# Altium schematic sheet WS2812B.SchDoc
size A3; SheetNumber: 3; SheetTotal: 4
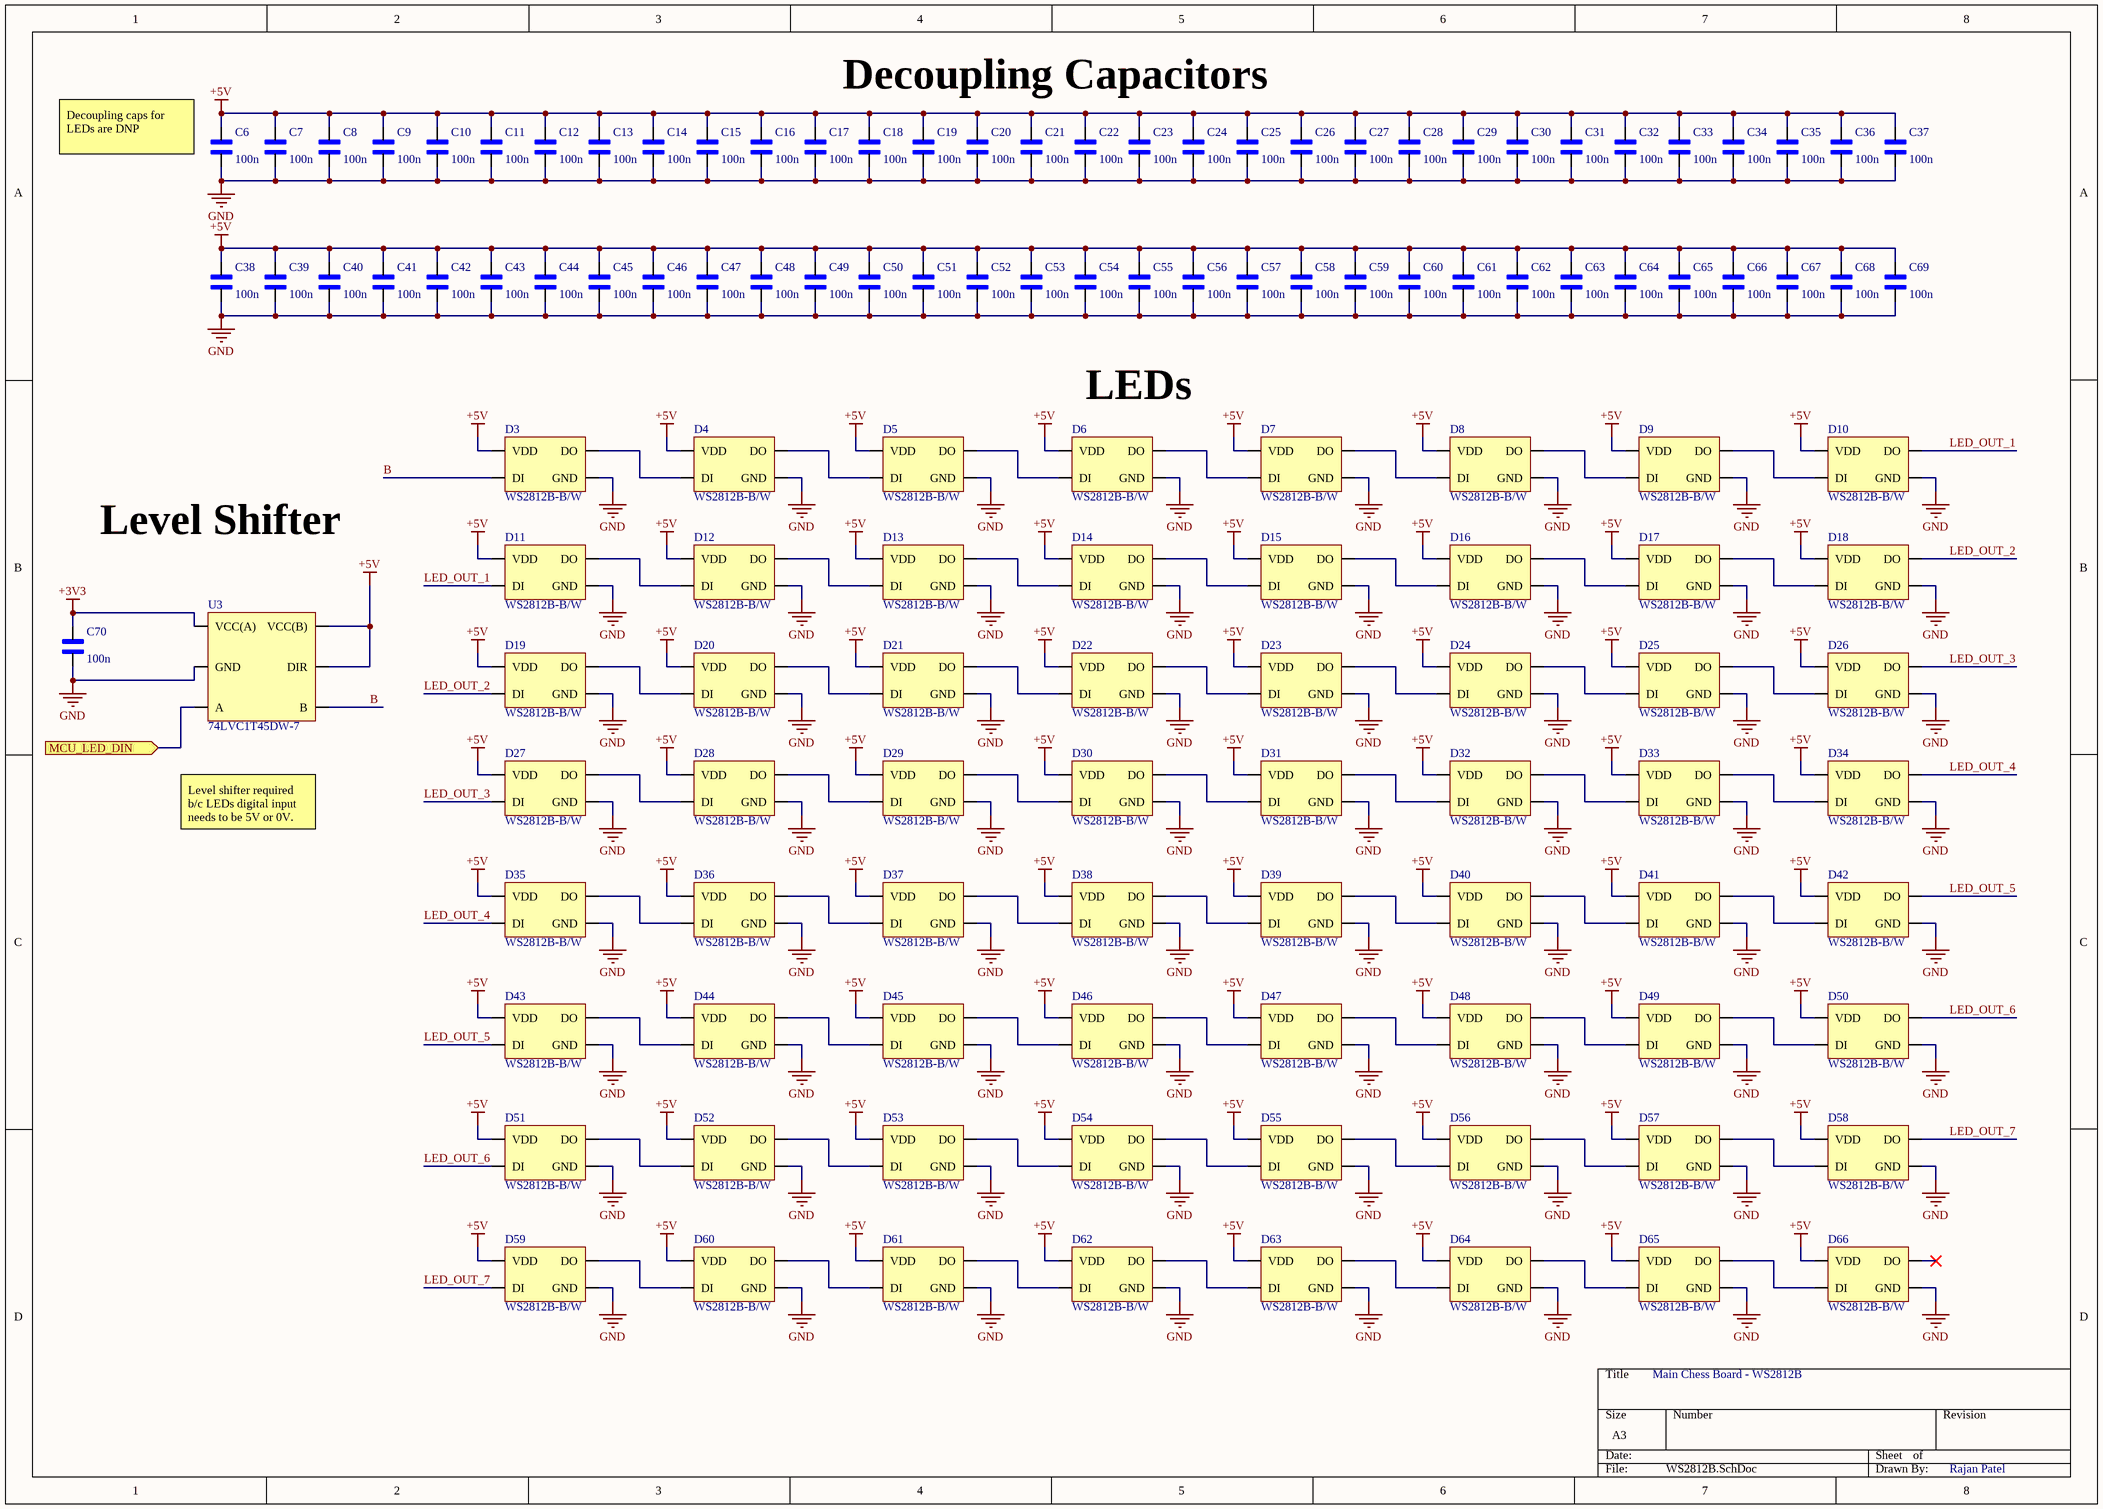
[diagram p0: WS2812B.SchDoc]

## Parts
C6  100n  [CAP 0805]
C7  100n  [CAP 0805]
C8  100n  [CAP 0805]
C9  100n  [CAP 0805]
C10  100n  [CAP 0805]
C11  100n  [CAP 0805]
C12  100n  [CAP 0805]
C13  100n  [CAP 0805]
C14  100n  [CAP 0805]
C15  100n  [CAP 0805]
C16  100n  [CAP 0805]
C17  100n  [CAP 0805]
C18  100n  [CAP 0805]
C19  100n  [CAP 0805]
C20  100n  [CAP 0805]
C21  100n  [CAP 0805]
C22  100n  [CAP 0805]
C23  100n  [CAP 0805]
C24  100n  [CAP 0805]
C25  100n  [CAP 0805]
C26  100n  [CAP 0805]
C27  100n  [CAP 0805]
C28  100n  [CAP 0805]
C29  100n  [CAP 0805]
C30  100n  [CAP 0805]
C31  100n  [CAP 0805]
C32  100n  [CAP 0805]
C33  100n  [CAP 0805]
C34  100n  [CAP 0805]
C35  100n  [CAP 0805]
C36  100n  [CAP 0805]
C37  100n  [CAP 0805]
C38  100n  [CAP 0805]
C39  100n  [CAP 0805]
C40  100n  [CAP 0805]
C41  100n  [CAP 0805]
C42  100n  [CAP 0805]
C43  100n  [CAP 0805]
C44  100n  [CAP 0805]
C45  100n  [CAP 0805]
C46  100n  [CAP 0805]
C47  100n  [CAP 0805]
C48  100n  [CAP 0805]
C49  100n  [CAP 0805]
C50  100n  [CAP 0805]
C51  100n  [CAP 0805]
C52  100n  [CAP 0805]
C53  100n  [CAP 0805]
C54  100n  [CAP 0805]
C55  100n  [CAP 0805]
C56  100n  [CAP 0805]
C57  100n  [CAP 0805]
C58  100n  [CAP 0805]
C59  100n  [CAP 0805]
C60  100n  [CAP 0805]
C61  100n  [CAP 0805]
C62  100n  [CAP 0805]
C63  100n  [CAP 0805]
C64  100n  [CAP 0805]
C65  100n  [CAP 0805]
C66  100n  [CAP 0805]
C67  100n  [CAP 0805]
C68  100n  [CAP 0805]
C69  100n  [CAP 0805]
C70  100n  [CAP 0805]
D3  WS2812B-B/W  [WS2812B-B/W]
D4  WS2812B-B/W  [WS2812B-B/W]
D5  WS2812B-B/W  [WS2812B-B/W]
D6  WS2812B-B/W  [WS2812B-B/W]
D7  WS2812B-B/W  [WS2812B-B/W]
D8  WS2812B-B/W  [WS2812B-B/W]
D9  WS2812B-B/W  [WS2812B-B/W]
D10  WS2812B-B/W  [WS2812B-B/W]
D11  WS2812B-B/W  [WS2812B-B/W]
D12  WS2812B-B/W  [WS2812B-B/W]
D13  WS2812B-B/W  [WS2812B-B/W]
D14  WS2812B-B/W  [WS2812B-B/W]
D15  WS2812B-B/W  [WS2812B-B/W]
D16  WS2812B-B/W  [WS2812B-B/W]
D17  WS2812B-B/W  [WS2812B-B/W]
D18  WS2812B-B/W  [WS2812B-B/W]
D19  WS2812B-B/W  [WS2812B-B/W]
D20  WS2812B-B/W  [WS2812B-B/W]
D21  WS2812B-B/W  [WS2812B-B/W]
D22  WS2812B-B/W  [WS2812B-B/W]
D23  WS2812B-B/W  [WS2812B-B/W]
D24  WS2812B-B/W  [WS2812B-B/W]
D25  WS2812B-B/W  [WS2812B-B/W]
D26  WS2812B-B/W  [WS2812B-B/W]
D27  WS2812B-B/W  [WS2812B-B/W]
D28  WS2812B-B/W  [WS2812B-B/W]
D29  WS2812B-B/W  [WS2812B-B/W]
D30  WS2812B-B/W  [WS2812B-B/W]
D31  WS2812B-B/W  [WS2812B-B/W]
D32  WS2812B-B/W  [WS2812B-B/W]
D33  WS2812B-B/W  [WS2812B-B/W]
D34  WS2812B-B/W  [WS2812B-B/W]
D35  WS2812B-B/W  [WS2812B-B/W]
D36  WS2812B-B/W  [WS2812B-B/W]
D37  WS2812B-B/W  [WS2812B-B/W]
D38  WS2812B-B/W  [WS2812B-B/W]
D39  WS2812B-B/W  [WS2812B-B/W]
D40  WS2812B-B/W  [WS2812B-B/W]
D41  WS2812B-B/W  [WS2812B-B/W]
D42  WS2812B-B/W  [WS2812B-B/W]
D43  WS2812B-B/W  [WS2812B-B/W]
D44  WS2812B-B/W  [WS2812B-B/W]
D45  WS2812B-B/W  [WS2812B-B/W]
D46  WS2812B-B/W  [WS2812B-B/W]
D47  WS2812B-B/W  [WS2812B-B/W]
D48  WS2812B-B/W  [WS2812B-B/W]
D49  WS2812B-B/W  [WS2812B-B/W]
D50  WS2812B-B/W  [WS2812B-B/W]
D51  WS2812B-B/W  [WS2812B-B/W]
D52  WS2812B-B/W  [WS2812B-B/W]
D53  WS2812B-B/W  [WS2812B-B/W]
D54  WS2812B-B/W  [WS2812B-B/W]
D55  WS2812B-B/W  [WS2812B-B/W]
D56  WS2812B-B/W  [WS2812B-B/W]
D57  WS2812B-B/W  [WS2812B-B/W]
D58  WS2812B-B/W  [WS2812B-B/W]
D59  WS2812B-B/W  [WS2812B-B/W]
D60  WS2812B-B/W  [WS2812B-B/W]
D61  WS2812B-B/W  [WS2812B-B/W]
D62  WS2812B-B/W  [WS2812B-B/W]
D63  WS2812B-B/W  [WS2812B-B/W]
D64  WS2812B-B/W  [WS2812B-B/W]
D65  WS2812B-B/W  [WS2812B-B/W]
D66  WS2812B-B/W  [WS2812B-B/W]
U3  74LVC1T45DW-7  [74LVC1T45DW-7]

## Ports
MCU_LED_DIN (in, see Microcontroller and Power Management[2C])

## Nets
+3V3: C70.2 U3.1(VCC(A))
+5V: C6.2 C7.2 C8.2 C9.2 C10.2 C11.2 C12.2 C13.2 C14.2 C15.2 C16.2 C17.2 C18.2 C19.2 C20.2 C21.2 C22.2 C23.2 C24.2 C25.2 C26.2 C27.2 C28.2 C29.2 C30.2 C31.2 C32.2 C33.2 C34.2 C35.2 C36.2 C37.2 C38.2 C39.2 C40.2 C41.2 C42.2 C43.2 C44.2 C45.2 C46.2 C47.2 C48.2 C49.2 C50.2 C51.2 C52.2 C53.2 C54.2 C55.2 C56.2 C57.2 C58.2 C59.2 C60.2 C61.2 C62.2 C63.2 C64.2 C65.2 C66.2 C67.2 C68.2 C69.2 D3.1(VDD) D4.1(VDD) D5.1(VDD) D6.1(VDD) D7.1(VDD) D8.1(VDD) D9.1(VDD) D10.1(VDD) D11.1(VDD) D12.1(VDD) D13.1(VDD) D14.1(VDD) D15.1(VDD) D16.1(VDD) D17.1(VDD) D18.1(VDD) D19.1(VDD) D20.1(VDD) D21.1(VDD) D22.1(VDD) D23.1(VDD) D24.1(VDD) D25.1(VDD) D26.1(VDD) D27.1(VDD) D28.1(VDD) D29.1(VDD) D30.1(VDD) D31.1(VDD) D32.1(VDD) D33.1(VDD) D34.1(VDD) D35.1(VDD) D36.1(VDD) D37.1(VDD) D38.1(VDD) D39.1(VDD) D40.1(VDD) D41.1(VDD) D42.1(VDD) D43.1(VDD) D44.1(VDD) D45.1(VDD) D46.1(VDD) D47.1(VDD) D48.1(VDD) D49.1(VDD) D50.1(VDD) D51.1(VDD) D52.1(VDD) D53.1(VDD) D54.1(VDD) D55.1(VDD) D56.1(VDD) D57.1(VDD) D58.1(VDD) D59.1(VDD) D60.1(VDD) D61.1(VDD) D62.1(VDD) D63.1(VDD) D64.1(VDD) D65.1(VDD) D66.1(VDD) U3.5(DIR) U3.6(VCC(B))
GND: C6.1 C7.1 C8.1 C9.1 C10.1 C11.1 C12.1 C13.1 C14.1 C15.1 C16.1 C17.1 C18.1 C19.1 C20.1 C21.1 C22.1 C23.1 C24.1 C25.1 C26.1 C27.1 C28.1 C29.1 C30.1 C31.1 C32.1 C33.1 C34.1 C35.1 C36.1 C37.1 C38.1 C39.1 C40.1 C41.1 C42.1 C43.1 C44.1 C45.1 C46.1 C47.1 C48.1 C49.1 C50.1 C51.1 C52.1 C53.1 C54.1 C55.1 C56.1 C57.1 C58.1 C59.1 C60.1 C61.1 C62.1 C63.1 C64.1 C65.1 C66.1 C67.1 C68.1 C69.1 C70.1 D3.4(GND) D4.4(GND) D5.4(GND) D6.4(GND) D7.4(GND) D8.4(GND) D9.4(GND) D10.4(GND) D11.4(GND) D12.4(GND) D13.4(GND) D14.4(GND) D15.4(GND) D16.4(GND) D17.4(GND) D18.4(GND) D19.4(GND) D20.4(GND) D21.4(GND) D22.4(GND) D23.4(GND) D24.4(GND) D25.4(GND) D26.4(GND) D27.4(GND) D28.4(GND) D29.4(GND) D30.4(GND) D31.4(GND) D32.4(GND) D33.4(GND) D34.4(GND) D35.4(GND) D36.4(GND) D37.4(GND) D38.4(GND) D39.4(GND) D40.4(GND) D41.4(GND) D42.4(GND) D43.4(GND) D44.4(GND) D45.4(GND) D46.4(GND) D47.4(GND) D48.4(GND) D49.4(GND) D50.4(GND) D51.4(GND) D52.4(GND) D53.4(GND) D54.4(GND) D55.4(GND) D56.4(GND) D57.4(GND) D58.4(GND) D59.4(GND) D60.4(GND) D61.4(GND) D62.4(GND) D63.4(GND) D64.4(GND) D65.4(GND) D66.4(GND) U3.2(GND)
B: D3.2(DI) U3.4(B)
LED_OUT_1: D10.3(DO) D11.2(DI)
LED_OUT_2: D18.3(DO) D19.2(DI)
LED_OUT_3: D26.3(DO) D27.2(DI)
LED_OUT_4: D34.3(DO) D35.2(DI)
LED_OUT_5: D42.3(DO) D43.2(DI)
LED_OUT_6: D50.3(DO) D51.2(DI)
LED_OUT_7: D58.3(DO) D59.2(DI)
MCU_LED_DIN: U3.3(A) ; port MCU_LED_DIN
NetD3_3: D3.3(DO) D4.2(DI)
NetD4_3: D4.3(DO) D5.2(DI)
NetD5_3: D5.3(DO) D6.2(DI)
NetD6_3: D6.3(DO) D7.2(DI)
NetD7_3: D7.3(DO) D8.2(DI)
NetD8_3: D8.3(DO) D9.2(DI)
NetD9_3: D9.3(DO) D10.2(DI)
NetD11_3: D11.3(DO) D12.2(DI)
NetD12_3: D12.3(DO) D13.2(DI)
NetD13_3: D13.3(DO) D14.2(DI)
NetD14_3: D14.3(DO) D15.2(DI)
NetD15_3: D15.3(DO) D16.2(DI)
NetD16_3: D16.3(DO) D17.2(DI)
NetD17_3: D17.3(DO) D18.2(DI)
NetD19_3: D19.3(DO) D20.2(DI)
NetD20_3: D20.3(DO) D21.2(DI)
NetD21_3: D21.3(DO) D22.2(DI)
NetD22_3: D22.3(DO) D23.2(DI)
NetD23_3: D23.3(DO) D24.2(DI)
NetD24_3: D24.3(DO) D25.2(DI)
NetD25_3: D25.3(DO) D26.2(DI)
NetD27_3: D27.3(DO) D28.2(DI)
NetD28_3: D28.3(DO) D29.2(DI)
NetD29_3: D29.3(DO) D30.2(DI)
NetD30_3: D30.3(DO) D31.2(DI)
NetD31_3: D31.3(DO) D32.2(DI)
NetD32_3: D32.3(DO) D33.2(DI)
NetD33_3: D33.3(DO) D34.2(DI)
NetD35_3: D35.3(DO) D36.2(DI)
NetD36_3: D36.3(DO) D37.2(DI)
NetD37_3: D37.3(DO) D38.2(DI)
NetD38_3: D38.3(DO) D39.2(DI)
NetD39_3: D39.3(DO) D40.2(DI)
NetD40_3: D40.3(DO) D41.2(DI)
NetD41_3: D41.3(DO) D42.2(DI)
NetD43_3: D43.3(DO) D44.2(DI)
NetD44_3: D44.3(DO) D45.2(DI)
NetD45_3: D45.3(DO) D46.2(DI)
NetD46_3: D46.3(DO) D47.2(DI)
NetD47_3: D47.3(DO) D48.2(DI)
NetD48_3: D48.3(DO) D49.2(DI)
NetD49_3: D49.3(DO) D50.2(DI)
NetD51_3: D51.3(DO) D52.2(DI)
NetD52_3: D52.3(DO) D53.2(DI)
NetD53_3: D53.3(DO) D54.2(DI)
NetD54_3: D54.3(DO) D55.2(DI)
NetD55_3: D55.3(DO) D56.2(DI)
NetD56_3: D56.3(DO) D57.2(DI)
NetD57_3: D57.3(DO) D58.2(DI)
NetD59_3: D59.3(DO) D60.2(DI)
NetD60_3: D60.3(DO) D61.2(DI)
NetD61_3: D61.3(DO) D62.2(DI)
NetD62_3: D62.3(DO) D63.2(DI)
NetD63_3: D63.3(DO) D64.2(DI)
NetD64_3: D64.3(DO) D65.2(DI)
NetD65_3: D65.3(DO) D66.2(DI)

Not connected (* = marked no-connect by the designer): D66 3(DO)*

## Notes on the sheet
- Decoupling Capacitors
- (near C6) Decoupling caps for LEDs are DNP
- (near D6) LEDs
- Level Shifter
- Level shifter required b/c LEDs digital input needs to be 5V or 0V.
- Main Chess Board - WS2812B
- Rajan Patel

## Library data of the parts
C6-C70 = CAP 0805: SnapEDA_Link: https://www.snapeda.com/parts/C2012X8R1H104K125AA/TDK/view-part/?ref=snap; Check_prices: https://www.snapeda.com/parts/C2012X8R1H104K125AA/TDK/view-part/?ref=eda; Value: *
D3-D66 = WS2812B-B/W: SMD5050 RGB LEDs(Built-in IC) ROHS; Manufacturer: Worldsemi; Supplier: LCSC; Supplier Part Number: C114586; Manufacturer Part Number: WS2812B-B/W
U3 = 74LVC1T45DW-7: Bus Transceiver, LVC/LCX/Z Series, 1-Func, 1-Bit, True Output, CMOS, PDSO6; Manufacturer: Diodes; Package Body Material: Plastic; Control Type: COMMON CONTROL; Count Direction: Bidirectional; Load/Preset Input: Yes; Max I(ol): 24mA; Number of Bits: 1; Number of Ports: 2; Output Characteristics: 3-STATE; Package Equivalence Code: TSSOP6,.08; Power Supplies: 3.3V; Max Supply Voltage: 5.5V; Min Supply Voltage: 1.65V; Qualification Status: Not Qualified; Supplier: Future Electronics; Supplier Part Number: 3070442; Manufacturer Part Number: 74LVC1T45DW-7; RoHS: Yes; Stock: 42000; Pricing: 3000=0.0512, 9000=0.0494, 15000=0.0485, 60000=0.0463, 90000=0.0449 (USD); Case/Package: TSSOP; Pins: 6; Package Shape: Rectangular; Terminal Finish: Tin; Min Operating Temperature: -40°C; Max Operating Temperature: 125°C; JESD-609 Code: e3; Output Polarity: True; JESD-30 Code: R-PDSO-G6; Logic Type: BUS TRANSCEIVER; Moisture Sensitivity Level: 1; Channels: 1; Package Style: SMALL OUTLINE, THIN PROFILE, SHRINK PITCHMeter; Packaging: Tape and Reel; Nominal Supply Voltage: 3.3V; Surface Mount: Yes; Technology: CMOS; Terminal Form: Gull Wing; Terminal Position: DUAL; Length: 2mm; Width: 1.25mm; Height - Seated (Max): 1.1mm; Terminal Pitch: 0.65mm; Temperature Grade: AUTOMOTIVE; Reach SVHC Compliant: Yes; RoHS Compliant: Yes; ComponentLink1URL: https://datasheet.ciiva.com:443/pdfs/VipMasterIC/IC/DIOD/DIOD-S-A0006644025/DIOD-S-A0006644025-1.pdf?src-supplier=IHS+Markit; ComponentLink1Description: https://datasheet.ciiva.com:443/pdfs/VipMasterIC/IC/DIOD/DIOD-S-A0006644025/DIOD-S-A0006644025-1.pdf?src-supplier=IHS+Markit; ComponentLink2URL: http://www.mouser.com/ds/2/115/74LVC1T45-318124.pdf?src-supplier=Mouser; ComponentLink2Description: http://www.mouser.com/ds/2/115/74LVC1T45-318124.pdf?src-supplier=Mouser; ComponentLink3URL: https://www.diodes.com/assets/Datasheets/74LVC1T45.pdf?src-supplier=Digikey; ComponentLink3Description: https://www.diodes.com/assets/Datasheets/74LVC1T45.pdf?src-supplier=Digikey; ComponentLink4URL: https://datasheet.octopart.com/74LVC1T45DW-7-Diodes-Inc.-datasheet-160640065.pdf?src-supplier=Newark; ComponentLink4Description: https://datasheet.octopart.com/74LVC1T45DW-7-Diodes-Inc.-datasheet-160640065.pdf?src-supplier=Newark; ComponentLink5URL: http://www.diodes.com/datasheets/74LVC1T45.pdf?src-supplier=Avnet; ComponentLink5Description: http://www.diodes.com/datasheets/74LVC1T45.pdf?src-supplier=Avnet